# EasyEDA schematic SCH_Output register_2021-10-31.json
TITLE: Output Register Electronic Scheme; REV: 1.0; Date: 2021-09-28; Sheet: 1/1; Drawn By: MarcosObel; Company: Zutup All Electronics
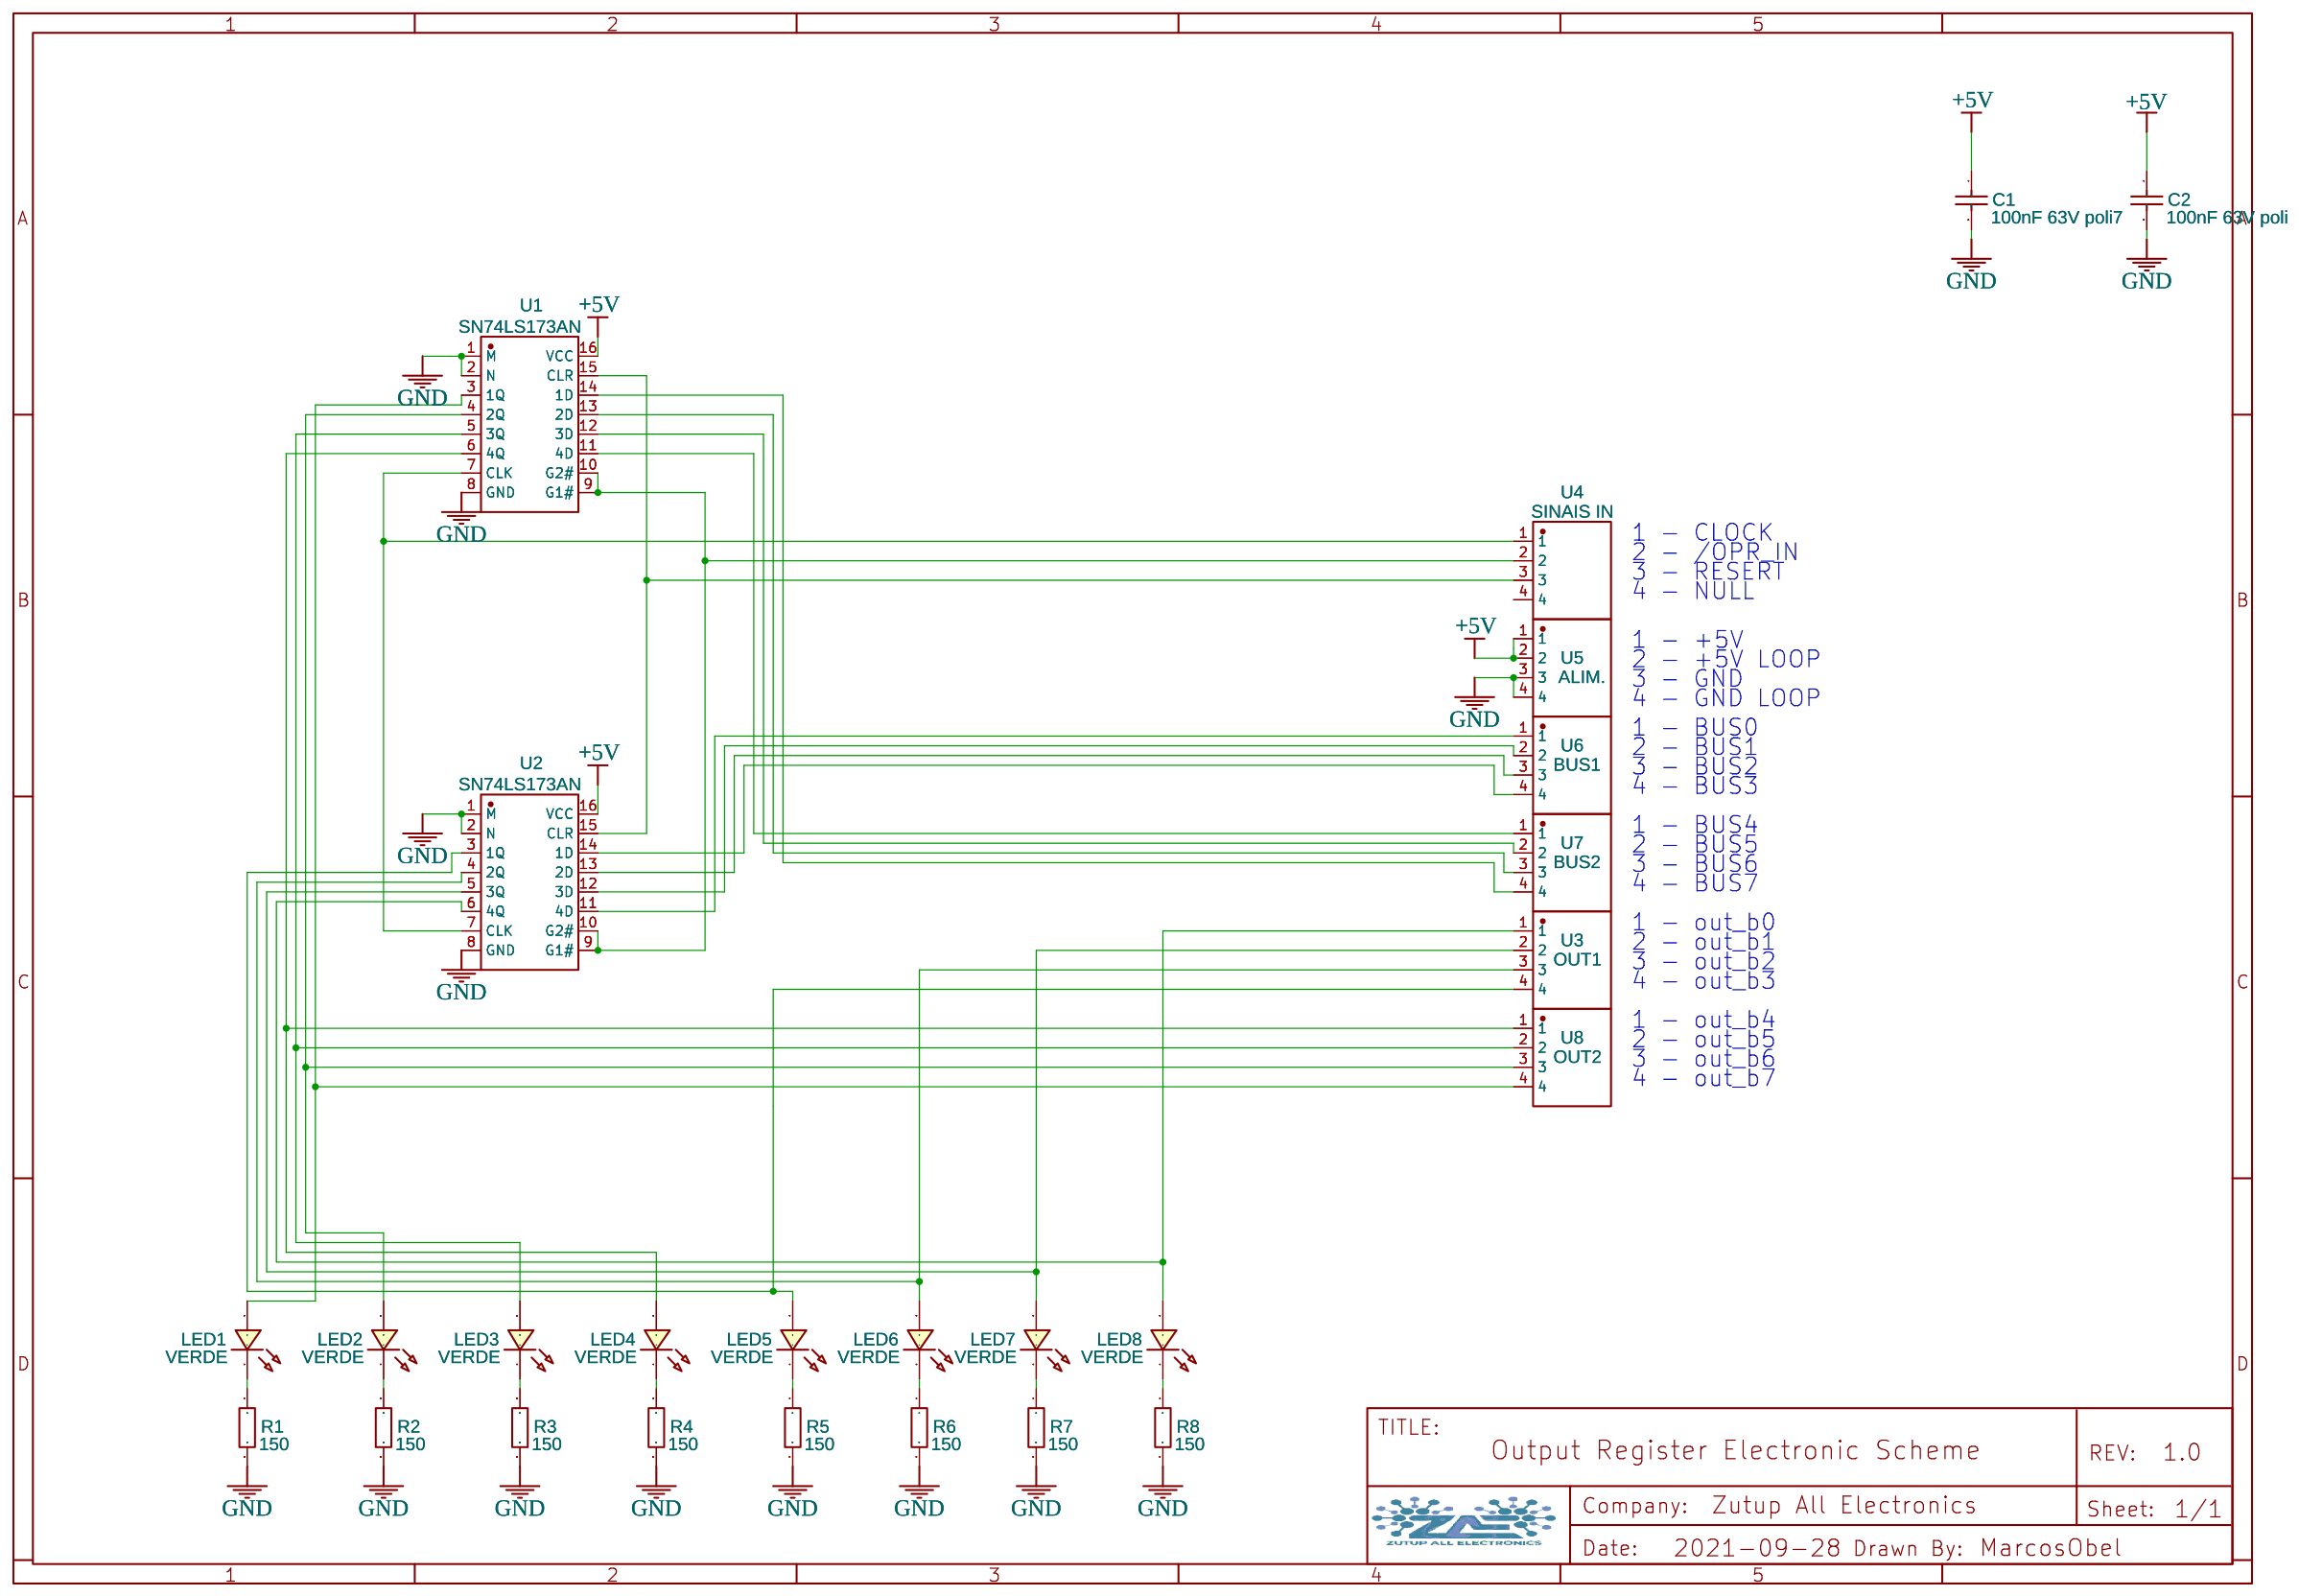
[diagram p0: schematic sheet]

## Parts
C1  100nF 63V poli7  [CAP-TH_L7.6-W3.8-P5.08-D0.51]
C2  100nF 63V poli  [CAP-TH_L7.6-W3.8-P5.08-D0.51]
LED1  VERDE  [LED-TH_BD3.0-P2.54-RD-GREEN]
LED2  VERDE  [LED-TH_BD3.0-P2.54-RD-GREEN]
LED3  VERDE  [LED-TH_BD3.0-P2.54-RD-GREEN]
LED4  VERDE  [LED-TH_BD3.0-P2.54-RD-GREEN]
LED5  VERDE  [LED-TH_BD3.0-P2.54-RD-GREEN]
LED6  VERDE  [LED-TH_BD3.0-P2.54-RD-GREEN]
LED7  VERDE  [LED-TH_BD3.0-P2.54-RD-GREEN]
LED8  VERDE  [LED-TH_BD3.0-P2.54-RD-GREEN]
R1  150  [RES-TH_BD3.0-L9.5-P13.50-D0.6]
R2  150  [RES-TH_BD3.0-L9.5-P13.50-D0.6]
R3  150  [RES-TH_BD3.0-L9.5-P13.50-D0.6]
R4  150  [RES-TH_BD3.0-L9.5-P13.50-D0.6]
R5  150  [RES-TH_BD3.0-L9.5-P13.50-D0.6]
R6  150  [RES-TH_BD3.0-L9.5-P13.50-D0.6]
R7  150  [RES-TH_BD3.0-L9.5-P13.50-D0.6]
R8  150  [RES-TH_BD3.0-L9.5-P13.50-D0.6]
U1  SN74LS173AN  [PDIP-16_L19.7-W6.6-P2.54-LS7.6-BL]
U2  SN74LS173AN  [PDIP-16_L19.7-W6.6-P2.54-LS7.6-BL]
U3  OUT1  [HDR-TH_4P-P2.54-D1.0]
U4  SINAIS IN  [HDR-TH_4P-P2.54-D1.0]
U5  ALIM.  [HDR-TH_4P-P2.54-D1.0]
U6  BUS1  [HDR-TH_4P-P2.54-D1.0]
U7  BUS2  [HDR-TH_4P-P2.54-D1.0]
U8  OUT2  [HDR-TH_4P-P2.54-D1.0]

## Library data of the parts
C1 C2 = SR305C105KAR: Supplier: LCSC; Supplier Part: C444741; Manufacturer: AVX; Contributor: LCSC; JLCPCB Part Class: Extended Part
LED1-LED8 = 264-7GD: Supplier: LCSC; Supplier Part: C605465; Manufacturer: Everlight Elec; Contributor: LCSC; JLCPCB Part Class: Extended Part
R1-R8 = CFR02SJ0823A10: Supplier: LCSC; Manufacturer: UniOhm; Supplier Part: C69876
U1 U2 = SN74LS173AN: Supplier: LCSC; Supplier Part: C1550125; Manufacturer: TI(德州仪器); Contributor: LCSC
U3-U8 = 171825-4: Supplier: LCSC; Supplier Part: C210162; Manufacturer: TE Connectivity; Contributor: LCSC; JLCPCB Part Class: Extended Part

## Nets
+5V: C1.1 C2.1 U1.16(VCC) U2.16(VCC) U5.1 U5.2
GND: C1.2 C2.2 R1.2 R2.2 R3.2 R4.2 R5.2 R6.2 R7.2 R8.2 U1.1(M) U1.2(N) U1.8(GND) U2.1(M) U2.2(N) U2.8(GND) U5.3 U5.4
Net-(LED1-1): LED1.1(-) R1.1
Net-(LED1-2): LED1.2(+) U1.3(1Q) U8.4
Net-(LED2-1): LED2.1(-) R2.1
Net-(LED2-2): LED2.2(+) U1.4(2Q) U8.3
Net-(LED3-1): LED3.1(-) R3.1
Net-(LED3-2): LED3.2(+) U1.5(3Q) U8.2
Net-(LED4-1): LED4.1(-) R4.1
Net-(LED4-2): LED4.2(+) U1.6(4Q) U8.1
Net-(LED5-1): LED5.1(-) R5.1
Net-(LED5-2): LED5.2(+) U2.3(1Q) U3.4
Net-(LED6-1): LED6.1(-) R6.1
Net-(LED6-2): LED6.2(+) U2.4(2Q) U3.3
Net-(LED7-1): LED7.1(-) R7.1
Net-(LED7-2): LED7.2(+) U2.5(3Q) U3.2
Net-(LED8-1): LED8.1(-) R8.1
Net-(LED8-2): LED8.2(+) U2.6(4Q) U3.1
Net-(U1-7): U1.7(CLK) U2.7(CLK) U4.1
Net-(U1-9): U1.9(G1#) U1.10(G2#) U2.9(G1#) U2.10(G2#) U4.2
Net-(U1-11): U1.11(4D) U7.1
Net-(U1-12): U1.12(3D) U7.2
Net-(U1-13): U1.13(2D) U7.3
Net-(U1-14): U1.14(1D) U7.4
Net-(U1-15): U1.15(CLR) U2.15(CLR) U4.3
Net-(U2-11): U2.11(4D) U6.1
Net-(U2-12): U2.12(3D) U6.2
Net-(U2-13): U2.13(2D) U6.3
Net-(U2-14): U2.14(1D) U6.4

Not connected (* = marked no-connect by the designer): U4 4

## Notes on the sheet
- 1 - CLOCK
- 2 - /OPR_IN
- 3 - RESERT
- 4 - NULL
- 1 - +5V
- 2 - +5V LOOP
- 3 - GND
- 4 - GND LOOP
- 1 - BUS0
- 2 - BUS1
- 3 - BUS2
- 4 - BUS3
- 1 - BUS4
- 2 - BUS5
- 3 - BUS6
- 4 - BUS7
- 1 - out_b0
- 2 - out_b1
- 3 - out_b2
- 4 - out_b3
- 1 - out_b4
- 2 - out_b5
- 3 - out_b6
- 4 - out_b7
